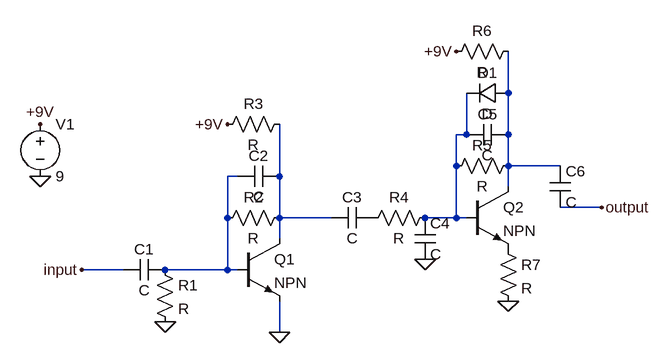
[diagram p0: schematic Draft4.asc]
Draft4.asc, the LTspice schematic file:
Version 4
SHEET 1 880 680
WIRE 624 0 624 -64
WIRE 560 64 560 0
WIRE 560 64 544 64
WIRE 624 64 624 0
WIRE 544 112 544 64
WIRE 624 112 624 64
WIRE 704 112 624 112
WIRE 208 128 192 128
WIRE 272 128 272 48
WIRE 624 144 624 112
WIRE 768 176 704 176
WIRE 192 192 192 128
WIRE 272 192 272 128
WIRE 352 192 272 192
WIRE 544 192 544 112
WIRE 544 192 496 192
WIRE 560 192 544 192
WIRE 272 224 272 192
WIRE 32 272 -32 272
WIRE 192 272 192 192
WIRE 192 272 96 272
WIRE 208 272 192 272
WIRE 272 368 272 320
FLAG -32 272 input
FLAG 272 368 0
FLAG 96 352 0
FLAG -96 48 +9V
FLAG -96 128 0
FLAG 192 48 +9V
FLAG 496 256 0
FLAG 544 -64 +9V
FLAG 624 320 0
FLAG 768 176 output
SYMBOL cap 96 256 R90
WINDOW 0 0 32 VBottom 2
WINDOW 3 32 32 VTop 2
SYMATTR InstName C1
SYMBOL res 80 256 R0
SYMATTR InstName R1
SYMBOL npn 208 224 R0
SYMATTR InstName Q1
SYMBOL res 288 176 R90
WINDOW 0 0 56 VBottom 2
WINDOW 3 32 56 VTop 2
SYMATTR InstName R2
SYMBOL cap 272 112 R90
WINDOW 0 0 32 VBottom 2
WINDOW 3 32 32 VTop 2
SYMATTR InstName C2
SYMBOL voltage -96 32 R0
SYMATTR InstName V1
SYMATTR Value 9
SYMBOL res 288 32 R90
WINDOW 0 0 56 VBottom 2
WINDOW 3 32 56 VTop 2
SYMATTR InstName R3
SYMBOL cap 416 176 R90
WINDOW 0 0 32 VBottom 2
WINDOW 3 32 32 VTop 2
SYMATTR InstName C3
SYMBOL res 512 176 R90
WINDOW 0 0 56 VBottom 2
WINDOW 3 32 56 VTop 2
SYMATTR InstName R4
SYMBOL cap 480 192 R0
SYMATTR InstName C4
SYMBOL npn 560 144 R0
SYMATTR InstName Q2
SYMBOL res 640 96 R90
WINDOW 0 0 56 VBottom 2
WINDOW 3 32 56 VTop 2
SYMATTR InstName R5
SYMBOL cap 624 48 R90
WINDOW 0 0 32 VBottom 2
WINDOW 3 32 32 VTop 2
SYMATTR InstName C5
SYMBOL diode 624 -16 R90
WINDOW 0 0 32 VBottom 2
WINDOW 3 32 32 VTop 2
SYMATTR InstName D1
SYMBOL res 640 -80 R90
WINDOW 0 0 56 VBottom 2
WINDOW 3 32 56 VTop 2
SYMATTR InstName R6
SYMBOL res 608 224 R0
SYMATTR InstName R7
SYMBOL cap 688 112 R0
SYMATTR InstName C6

The netlist it stands for:
* Draft4.asc
C1 N003 input C
R1 N003 0 R
Q1 N004 N003 0 0 NPN
R2 N004 N003 R
C2 N004 N003 C
V1 +9V 0 9
R3 N004 +9V R
C3 P001 N004 C
R4 N002 P001 R
C4 N002 0 C
Q2 N001 N002 P002 0 NPN
R5 N001 N002 R
C5 N001 N002 C
D1 N001 N002 D
R6 N001 +9V R
R7 P002 0 R
C6 N001 output C
.model D D
.lib standard.dio
.model NPN NPN
.model PNP PNP
.lib standard.bjt
.backanno
.end